# EAGLE design DGL (EAGLE 6.6.0)
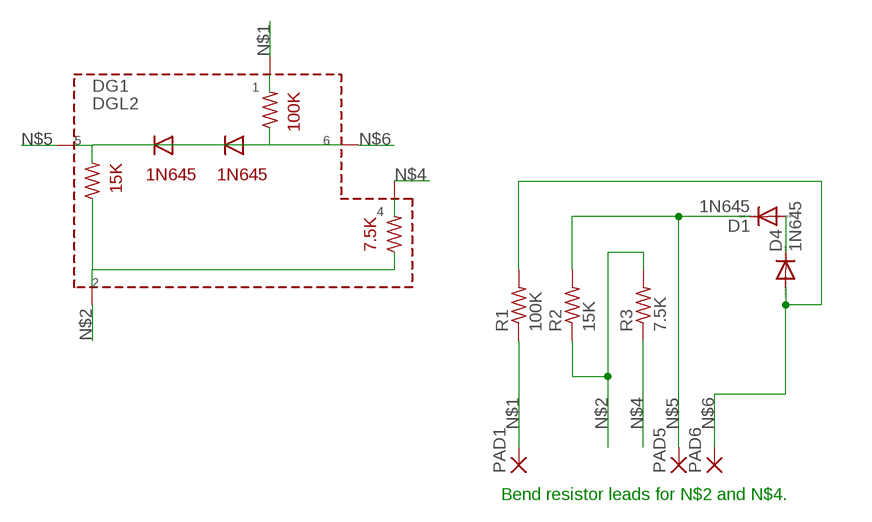
[diagram p0: schematic, sheet 1]

## Parts
D1  1N645  DIODE-DO34-7  [DO34-7]
D4  1N645  DIODE-DO34-7  [DO34-7]
DG1  DGL2  [DGL2]
PAD1  1,6/0,8  [1,6/0,8]
PAD5  1,6/0,8  [1,6/0,8]
PAD6  1,6/0,8  [1,6/0,8]
R1  100K  R-US_0207/7  [0207/7]
R2  15K  R-US_0207/7  [0207/7]
R3  7.5K  R-US_0207/7  [0207/7]

## Nets
N$1: DG1.P$1 PAD1.1(P) R1.1
N$2: DG1.P$2 R2.1 R3.2
N$4: DG1.P$4 R3.1
N$5: D1.C DG1.P$5 PAD5.1(P) R2.2
N$6: D4.A DG1.P$6 PAD6.1(P) R1.2
N$7: D1.A D4.C

## Notes on the sheet
- Bend resistor leads for N$2 and N$4.

## Library data of the parts
D1 D4 = diode:DIODE-: DIODE
DG1 = dec-con:DGL2: Diode Gate Logic Block
PAD1 PAD5 PAD6 = wirepad:1,6/0,8: THROUGH-HOLE PAD
R1-R3 = rcl:R-US_: RESISTOR, American symbol

## Net classes
0 default: width 0.406 mm

## Board
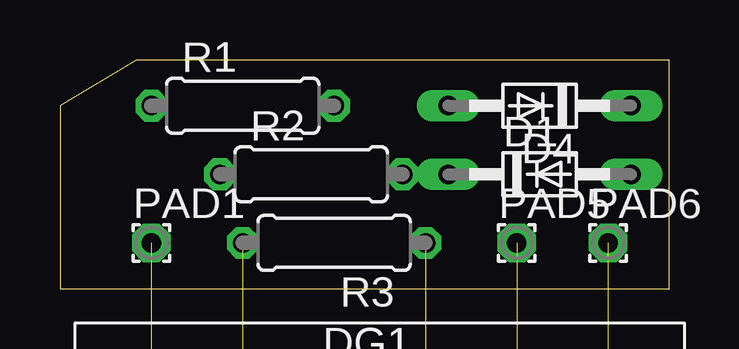
[diagram p1: board, top side]
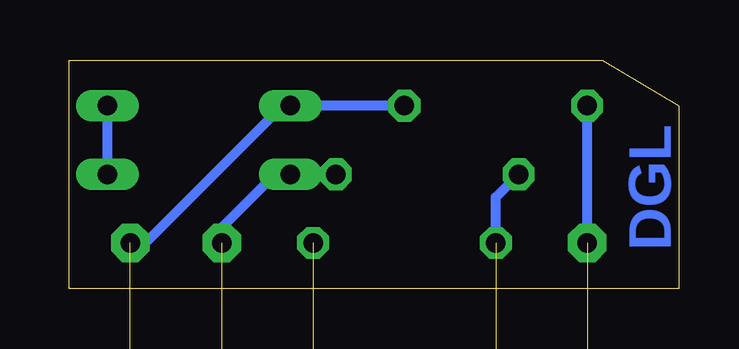
[diagram p2: board, bottom side, seen from below]

Size 25.4 x 9.53 mm. Coordinates in mm from the lower left corner, seen from the top.
Outline: 0,0 25.4,0 25.4,9.53 3.17,9.53 0,7.62 0,0
Copper layers (1*16): Top 0.035mm / dielectric 1.5mm / Bottom 0.035mm
Design rules "10mils": minimum track width 10mil, minimum drill 24mil, track to track 10mil, track to pad 10mil, pad to pad 10mil, via to via 10mil, smd to smd 10mil, copper to edge 25mil, drill to drill 10mil, minimum pad ring 10mil, minimum via ring 8mil, stop-mask expansion 0mil, vias tented up to drill 0mil, thermal gap 10mil

### Footprints (pad centres in the part's own frame; a part is rotated, then mirrored left to right if it is on the bottom)
DO34-7 = drill 0.813 long: A 3.81,0; C -3.81,0
DGL2 = drill 0.813: P$1 -9.525,0; P$2 -5.715,0; P$3 -1.905,0; P$4 1.905,0; P$5 5.715,0; P$6 9.525,0
1,6/0,8 = drill 0.813 pad 1.6 octagon: 1 0,0
0207/7 = drill 0.813 octagon: 1 -3.81,0; 2 3.81,0

### Placement (x,y rotation side)
D1  20,4.76 0 top
D4  20,7.62 180 top
DG1  13.34,-3.81 0 top  (outside the outline)
PAD1  3.81,1.91 0 top
PAD5  19.05,1.91 0 top
PAD6  22.86,1.91 0 top
R1  7.62,7.62 0 top
R2  10.48,4.76 0 top
R3  11.43,1.91 180 top

### Tracks (layer width: path | path; a pad name or v marks a point on that pad's centre or on a via)
N$1  (1 unrouted)
  Bottom 0.406: PAD1.1 R1.1
N$2  (1 unrouted)
  Bottom 0.406: R3.2 7.62,3.81 R2.1
N$4  (1 unrouted)
N$5  (1 unrouted)
  Bottom 0.406: R2.2 D1.C 16.83,4.76 19.05,2.54 PAD5.1
N$6  (1 unrouted)
  Bottom 0.406: R1.2 D4.A 16.51,7.62 22.23,1.91 PAD6.1
N$7
  Bottom 0.406: D1.A D4.C

### Text on the board
Bottom: DGL